# EAGLE design mpg-200-prototype_v2 (EAGLE 6.2)
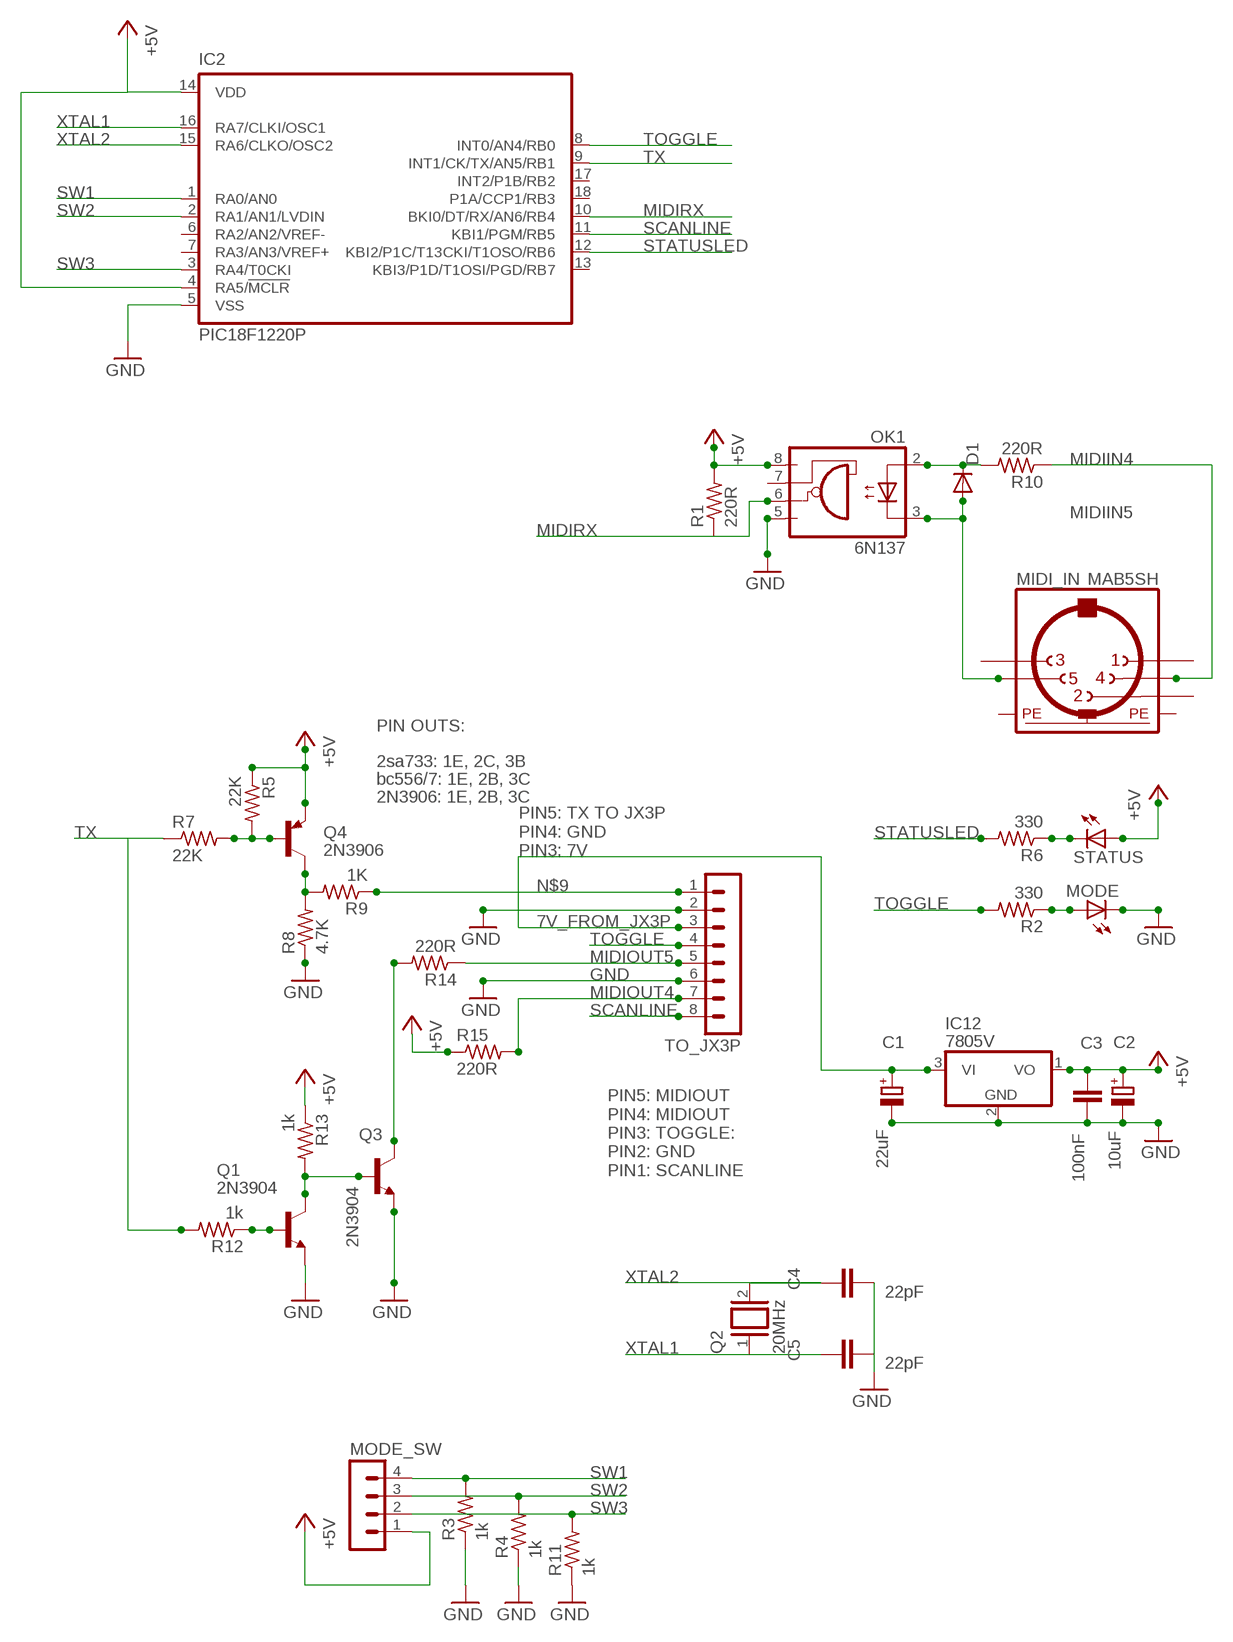
[diagram p0: schematic, sheet 1]

## Parts
C1  22uF  CPOL-EUE2.5-5  [E2,5-5]
C2  10uF  CPOL-EUE2.5-5  [E2,5-5]
C3  100nF  C-EUC0805  [C0805]
C4  22pF  C-EUC0805  [C0805]
C5  22pF  C-EUC0805  [C0805]
D1  DIODE-SOD80C  [SOD80C]
IC2  PIC18F1220P  [DIL18]
IC12  7805V  7805L  [TO92]
MIDI_IN  MAB5SH  [MAB5SH]
MODE  LED3MM  [LED3MM]
MODE_SW  MA04-1  [MA04-1]
OK1  6N137  [DIL08]
Q1  2N3904  [TO92]
Q2  20MHz  XTAL/S  [QS]
Q3  2N3904  [TO92]
Q4  2N3906  [TO92]
R1  220R  R-US_R0805  [R0805]
R2  330  R-US_R0805  [R0805]
R3  1k  R-US_R0805  [R0805]
R4  1k  R-US_R0805  [R0805]
R5  22K  R-US_R0805  [R0805]
R6  330  R-US_R0805  [R0805]
R7  22K  R-US_R0805  [R0805]
R8  4.7K  R-US_R0805  [R0805]
R9  1K  R-US_R0805  [R0805]
R10  220R  R-US_R0805  [R0805]
R11  1k  R-US_R0805  [R0805]
R12  1k  R-US_R0805  [R0805]
R13  1k  R-US_R0805  [R0805]
R14  220R  R-US_R0805  [R0805]
R15  220R  R-US_R0805  [R0805]
STATUS  LED3MM  [LED3MM]
TO_JX3P  MA08-1  [MA08-1]

## Nets
7V_FROM_JX3P: C1.+ IC12.3(VI) TO_JX3P.3
+5V: C2.+ C3.1 IC2.4(RA5/!MCLR) IC2.14(VDD) IC12.1(VO) MODE_SW.1 OK1.8(VCC) Q4.1(E) R1.2 R5.1 R13.1 R15.1 STATUS.A
GND: C1.- C2.- C3.2 C4.2 C5.2 IC2.5(VSS) IC12.2(GND) MODE.K(C) OK1.5(GND) Q1.1(E) Q3.1(E) R3.1 R4.1 R8.1 R11.1 TO_JX3P.2 TO_JX3P.6
MIDIIN4: MIDI_IN.4 R10.1
MIDIIN5: D1.A MIDI_IN.5 OK1.3(C)
MIDIOUT4: R15.2 TO_JX3P.7
MIDIOUT5: R14.1 TO_JX3P.5
MIDIRX: IC2.10(BKI0/DT/RX/AN6/RB4) OK1.6(VO) R1.1
N$1: R6.1 STATUS.K(C)
N$2: Q4.2(B) R5.2 R7.2
N$3: MODE.A R2.1
N$4: Q1.2(B) R12.1
N$5: D1.C OK1.2(A) R10.2
N$6: Q4.3(C) R8.2 R9.2
N$7: Q1.3(C) Q3.2(B) R13.2
N$8: Q3.3(C) R14.2
N$9: R9.1 TO_JX3P.1
SCANLINE: IC2.11(KBI1/PGM/RB5) TO_JX3P.8
STATUSLED: IC2.12(KBI2/P1C/T13CKI/T1OSO/RB6) R6.2
SW1: IC2.1(RA0/AN0) MODE_SW.4 R3.2
SW2: IC2.2(RA1/AN1/LVDIN) MODE_SW.3 R4.2
SW3: IC2.3(RA4/T0CKI) MODE_SW.2 R11.2
TOGGLE: IC2.8(INT0/AN4/RB0) R2.2 TO_JX3P.4
TX: IC2.9(INT1/CK/TX/AN5/RB1) R7.1 R12.2
XTAL1: C5.1 IC2.16(RA7/CLKI/OSC1) Q2.1
XTAL2: C4.1 IC2.15(RA6/CLKO/OSC2) Q2.2
Unconnected: IC2.6(RA2/AN2/VREF-) IC2.7(RA3/AN3/VREF+) IC2.13(KBI3/P1D/T1OSI/PGD/RB7) IC2.17(INT2/P1B/RB2) IC2.18(P1A/CCP1/RB3) MIDI_IN.1 MIDI_IN.2 MIDI_IN.3 OK1.7(VE)

## Notes on the sheet
- PIN OUTS:
- 2sa733: 1E, 2C, 3B
- bc556/7: 1E, 2B, 3C
- 2N3906: 1E, 2B, 3C
- PIN5: TX TO JX3P
  PIN4: GND
  PIN3: 7V
- PIN5: MIDIOUT
  PIN4: MIDIOUT
  PIN3: TOGGLE:
  PIN2: GND
  PIN1: SCANLINE

## Power pins joined to a net without a drawn wire
PE: MIDI_IN.PE MIDI_IN.PE@(PE)

## Library data of the parts
C1 C2 = rcl:CPOL-EU: POLARIZED CAPACITOR, European symbol
C3-C5 = resistor:C-EU: CAPACITOR, European symbol
D1 = diode:DIODE-: DIODE
IC2 = microchip:PIC18F1*20: 18/20/28-Pin High-Performance, Enhanced Flash Microcontrollers with 10-bit A/D and nanoWatt Technology Source: ww1.microchip.com/downloads/en/DeviceDoc/39605c.pdf; MF: MICROCHIP; MPN: PIC18F1220-I/P; OC_FARNELL: 9761977; OC_NEWARK: 92C2429
IC12 = joakim:78*: Positive VOLTAGE REGULATOR Source: http://cache.national.com/ds/LM/LM78L05.pdf http://www.fairchildsemi.com/ds/LM/LM7805.pdf
MIDI_IN = con-hirschmann:MAB5SH: Female CONNECTOR 5 pins 90 deg. with shield, horizontal (DIN 41524)
MODE STATUS = led:LED: LED OSRAM: - CHIPLED LG R971, LG N971, LY N971, LG Q971, LY Q971, LO R971, LY R971 LH N974, LH R974 LS Q976, LO Q976, LY Q976 LO Q996 - Hyper CHIPLED LW Q18S LB Q993, LB Q99A, LB R99A - SideLED LS A670, LO A670, LY A670, LG A670, LP A670 LB A673, LV A673, LT A673, LW A673 LH A674 LY A675 LS A676, LA A676, LO A676, LY A676, LW A676 LS A679, LY A679, LG A679 - Hyper Micro SIDELED® LS Y876, LA Y876, LO Y876, LY Y876 LT Y87S - SmartLED LW L88C, LW L88S LB L89C, LB L89S, LG L890 LS L89K, LO L89K, LY L89K LS L896, LA L896, LO L896, LY L896 - TOPLED LS T670, LO T670, LY T670, LG T670, LP T670 LSG T670, LSP T670, LSY T670, LOP T670, LYG T670 LG T671, LOG T671, LSG T671 LB T673, LV T673, LT T673, LW T673 LH T674 LS T676, LA T676, LO T676, LY T676, LB T676, LH T676, LSB T676, LW T676 LB T67C, LV T67C, LT T67C, LS T67K, LO T67K, LY T67K, LW E67C LS E67B, LA E67B, LO E67B, LY E67B, LB E67C, LV E67C, LT E67C LW T67C LS T679, LY T679, LG T679 LS T770, LO T770, LY T770, LG T770, LP T770 LB T773, LV T773, LT T773, LW T773 LH T774 LS E675, LA E675, LY E675, LS T675 LS T776, LA T776, LO T776, LY T776, LB T776 LHGB T686 LT T68C, LB T68C - Hyper Mini TOPLED® LB M676 - Mini TOPLED Santana® LG M470 LS M47K, LO M47K, LY M47K Source: http://www.osram.convergy.de LUXEON: - LUMILED® LXK2-PW12-R00, LXK2-PW12-S00, LXK2-PW14-U00, LXK2-PW14-V00 LXK2-PM12-R00, LXK2-PM12-S00, LXK2-PM14-U00 LXK2-PE12-Q00, LXK2-PE12-R00, LXK2-PE12-S00, LXK2-PE14-T00, LXK2-PE14-U00 LXK2-PB12-K00, LXK2-PB12-L00, LXK2-PB12-M00, LXK2-PB14-N00, LXK2-PB14-P00, LXK2-PB14-Q00 LXK2-PR12-L00, LXK2-PR12-M00, LXK2-PR14-Q00, LXK2-PR14-R00 LXK2-PD12-Q00, LXK2-PD12-R00, LXK2-PD12-S00 LXK2-PH12-R00, LXK2-PH12-S00 LXK2-PL12-P00, LXK2-PL12-Q00, LXK2-PL12-R00 Source: www.luxeon.com KINGBRIGHT: KA-3528ASYC Source: www.kingbright.com
MODE_SW = con-lstb:MA04-1: PIN HEADER; OC_FARNELL: unknown; OC_NEWARK: unknown
OK1 = optocoupler:6N137: MOTOROLA OPTO COUPLER
Q1 Q3 = joakim:2N3904: NPN Transistor
Q2 = special:XTAL/S: CRYSTAL
Q4 = joakim:2N3906: PNP Transistor
R1-R15 = resistor:R-US_: RESISTOR, American symbol
TO_JX3P = con-lstb:MA08-1: PIN HEADER

## Board
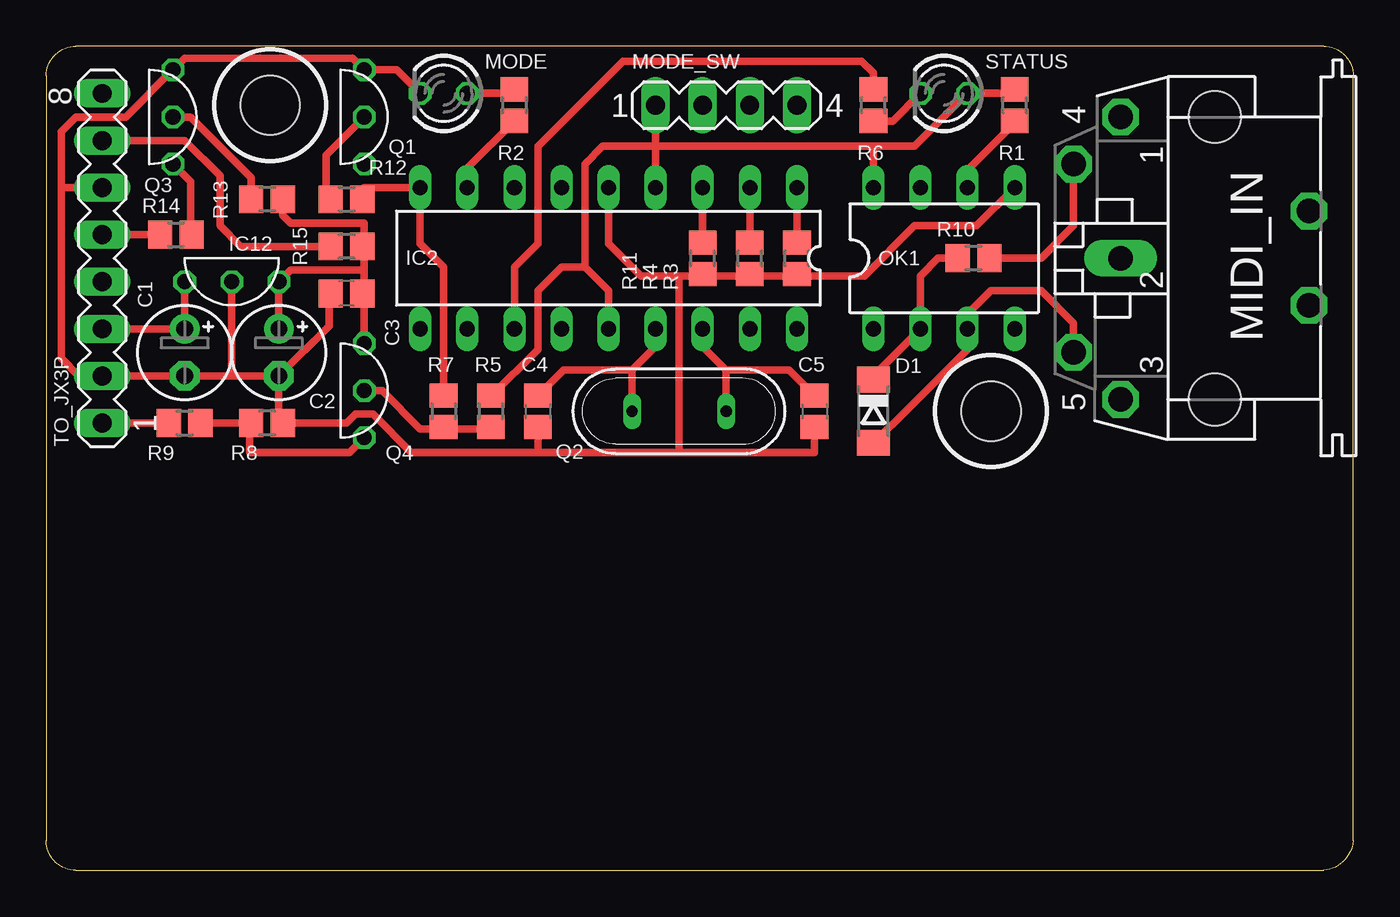
[diagram p1: board, top side]
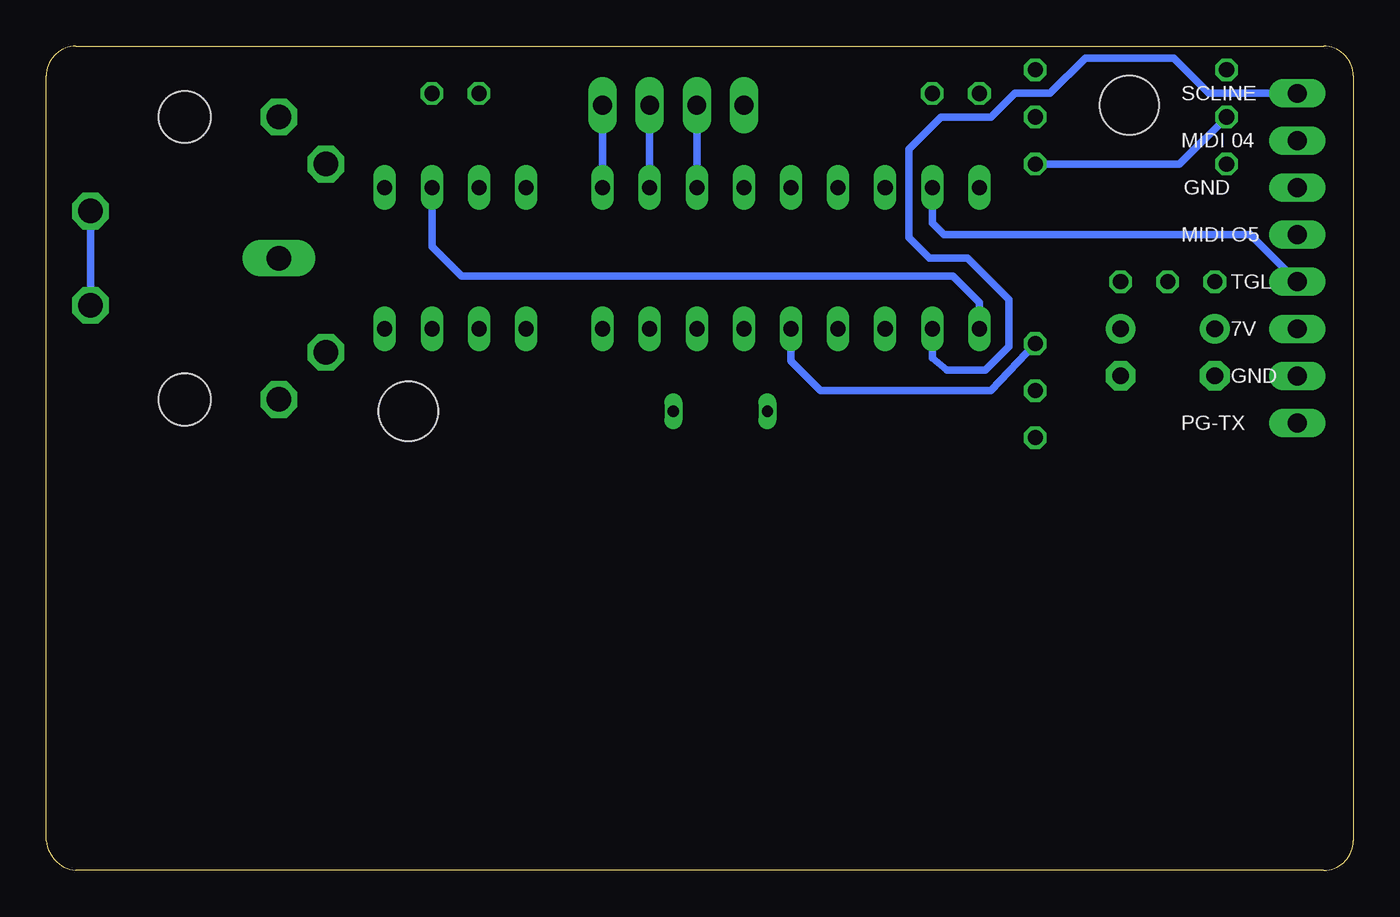
[diagram p2: board, bottom side, seen from below]

Size 70.48 x 44.45 mm. Coordinates in mm from the lower left corner, seen from the top.
Outline: 1.59,0 68.9,0 arc80 70.48,1.59 70.48,42.86 arc90 68.9,44.45 1.59,44.45 arc90 0,42.86 0,1.59 arc90 1.59,0
Copper layers (1*16): Top 0.0356mm / dielectric 1.5011mm / Bottom 0.0356mm
Design rules: minimum track width 6mil, minimum drill 13mil, track to track 6mil, track to pad 6mil, pad to pad 6mil, via to via 6mil, smd to smd 6mil, copper to edge 15mil, drill to drill 6mil, minimum pad ring 7mil, minimum via ring 7mil, stop-mask expansion 3mil, vias tented up to drill 0mil, thermal gap 10mil
Holes 3.2 mm at 50.96,24.77 12.06,41.27

### Footprints (pad centres in the part's own frame; a part is rotated, then mirrored left to right if it is on the bottom)
E2,5-5 = drill 0.9 pad 1.6: + -1.27,0 | drill 0.9 pad 1.6 octagon: - 1.27,0
C0805 = smd 1.3 x 1.5: 1 -0.85,0; 2 0.85,0
SOD80C = smd 1.4 x 1.8: A 1.7,0; C -1.7,0
DIL18 = drill 0.813 long: 1 -10.16,-3.81; 2 -7.62,-3.81; 3 -5.08,-3.81; 4 -2.54,-3.81; 5 0,-3.81; 6 2.54,-3.81; 7 5.08,-3.81; 8 7.62,-3.81; 9 10.16,-3.81; 10 10.16,3.81; 11 7.62,3.81; 12 5.08,3.81; 13 2.54,3.81; 14 0,3.81; 15 -2.54,3.81; 16 -5.08,3.81; 17 -7.62,3.81; 18 -10.16,3.81
TO92 = drill 0.813 octagon: 1 -2.54,0; 2 0,0; 3 2.54,0
MAB5SH = drill 1.321 octagon: 1 7.62,5.08; 3 -7.62,5.08; 4 5.08,7.62; 5 -5.08,7.62; PE -2.54,-5.08; PE@ 2.54,-5.08 | drill 1.321 long: 2 0,5.08 | hole 2.794: 7.62,0; -7.62,0
LED3MM = drill 0.813 octagon: A -1.27,0; K 1.27,0
MA04-1 = drill 1.016 long: 1 -3.81,0; 2 -1.27,0; 3 1.27,0; 4 3.81,0
DIL08 = drill 0.813 long: 1 -3.81,-3.81; 2 -1.27,-3.81; 3 1.27,-3.81; 4 3.81,-3.81; 5 3.81,3.81; 6 1.27,3.81; 7 -1.27,3.81; 8 -3.81,3.81
QS = drill 0.61 long: 1 -2.54,0; 2 2.54,0
R0805 = smd 1.3 x 1.5: 1 -0.85,0; 2 0.85,0
MA08-1 = drill 1.016 long: 1 -8.89,0; 2 -6.35,0; 3 -3.81,0; 4 -1.27,0; 5 1.27,0; 6 3.81,0; 7 6.35,0; 8 8.89,0

### Placement (x,y rotation side)
C1  7.46,27.94 270 top
C2  12.54,27.94 270 top
C3  16.19,31.11 180 top
C4  26.51,24.77 270 top
C5  41.43,24.77 270 top
D1  44.61,24.77 270 top
IC2  30.32,33.02 180 top
IC12  10,31.75 180 top
MIDI_IN  63.02,33.02 90 top
MODE  21.43,41.91 180 top
MODE_SW  36.67,41.27 0 top
OK1  48.42,33.02 0 top
Q1  17.14,40.64 270 top
Q2  34.13,24.77 180 top
Q3  6.83,40.64 270 top
Q4  17.14,25.88 270 top
R1  52.23,41.27 90 top
R2  25.24,41.27 270 top
R3  40.48,33.02 90 top
R4  37.94,33.02 90 top
R5  23.97,24.77 270 top
R6  44.61,41.27 90 top
R7  21.43,24.77 270 top
R8  11.91,24.13 180 top
R9  7.46,24.13 0 top
R10  50.01,33.02 180 top
R11  35.4,33.02 90 top
R12  16.19,36.2 0 top
R13  11.91,36.2 180 top
R14  6.99,34.29 0 top
R15  16.19,33.66 180 top
STATUS  48.42,41.91 180 top
TO_JX3P  3.02,33.02 90 top

### Tracks (layer width: path | path; a pad name or v marks a point on that pad's centre or on a via)
7V_FROM_JX3P
  Top 0.406: IC12.3 C1.+ TO_JX3P.3
+5V
  Top 0.406: IC2.14 30.32,31.27 29.05,32.54 | 29.05,32.54 29.05,38.1 30,39.05 32.86,39.05 | 17.14,32.38 17.14,33.97 17.04,34.08 R15.1 17.14,33.76 17.14,34.92 13.18,34.92 12.76,35.34 R13.1 | 17.14,32.38 17.14,31.85 C3.1 17.04,31.54 17.14,31.43 Q4.1 | 17.14,32.38 13.18,32.38 IC12.1 C2.+ | R5.1 24.03,25.61 26.51,28.1 26.51,31.27 27.78,32.54 29.05,32.54 | R1.2 52.23,41.91 STATUS.A 46.83,39.05 44.61,39.05 | MODE_SW.1 32.86,39.05 | 32.86,39.05 44.61,39.05 | OK1.8 44.61,39.05 | 32.86,39.05 IC2.4
  Bottom 0.406: Q4.1 19.53,25.88 28.73,25.88 30.32,27.46 IC2.14
GND
  Top 0.406: C2.- 12.54,24.13 R8.1 16.19,24.13 16.67,24.61 17.62,24.61 19.68,22.54 26.51,22.54 | IC2.5 30.32,33.81 32.07,32.07 34.13,32.07 | 26.51,22.54 34.29,22.54 | 34.29,22.54 41.43,22.54 C5.2 | 35.56,32.07 35.46,32.17 R11.1 | 35.56,32.07 37.84,32.07 | 35.56,32.07 34.13,32.07 | 34.13,32.07 34.13,22.7 34.29,22.54 | C2.- 15.24,29.37 15.24,31.65 C3.2 | IC12.2 10,26.67 | 10,26.67 C1.- TO_JX3P.2 1.75,26.67 0.79,27.62 0.79,36.83 | 10,26.67 C2.- | C4.2 26.51,22.54 | 0.79,36.83 0.79,39.85 1.59,40.64 4.29,40.64 Q3.1 7.46,43.81 16.51,43.81 Q1.1 18.89,43.18 MODE.K | TO_JX3P.6 0.79,36.83 | 37.84,32.07 40.64,32.07 | 40.64,32.07 44.13,32.07 46.83,34.77 50.16,34.77 OK1.5 | 37.84,32.07 R4.1 | R3.1 40.54,32.17 40.64,32.07
MIDIIN4
  Top 0.406: MIDI_IN.4 55.4,34.77 53.66,33.02 R10.1
MIDIIN5
  Top 0.406: D1.A 44.72,23.18 45.88,24.29 49.69,28.1 OK1.3 49.69,30 50.96,31.27 53.66,31.27 55.4,29.53 MIDI_IN.5
MIDIOUT4
  Top 0.406: R15.2 10.48,33.66 9.37,34.77 9.37,37.47 7.46,39.37 TO_JX3P.7
MIDIOUT5
  Top 0.406: TO_JX3P.5 R14.1
MIDIRX
  Top 0.406: R1.1 52.23,40.32 49.69,37.78 OK1.6
  Bottom 0.406: IC2.10 20.16,30.64 21.59,32.07 48.1,32.07 49.69,33.66 OK1.6
N$1
  Top 0.406: R6.1 45.66,40.42 STATUS.K
N$2
  Top 0.406: Q4.2 18.1,25.88 20.16,23.81 21.33,23.81 R7.2 21.43,23.81 23.87,23.81 R5.2
N$3
  Top 0.406: MODE.A 25.03,41.91 R2.1
N$4
  Top 0.406: Q1.2 15.08,38.58 15.08,36.46 R12.1
N$5
  Top 0.406: 49.37,33.02 R10.2 | D1.C 44.72,26.78 OK1.2 47.15,32.07 48.1,33.02 R10.2 | 49.1,33.08 R10.2
N$6
  Top 0.406: Q4.3 16.35,22.54 10.95,22.54 10.95,24.03 R8.2 R9.2
N$7
  Top 0.406: Q3.2 7.78,40.64 11.06,37.36 R13.2
  Bottom 0.406: Q1.3 9.37,38.1 Q3.2
N$8
  Top 0.406: Q3.3 7.78,37.15 7.78,33.87 R14.2
N$9
  Top 0.406: TO_JX3P.1 R9.1
PE
  Bottom 0.406: MIDI_IN.PE@ MIDI_IN.PE
SCANLINE
  Bottom 0.406: TO_JX3P.8 7.78,41.91 9.68,43.81 14.45,43.81 16.35,41.91 18.26,41.91 19.53,40.64 22.23,40.64 23.97,38.89 23.97,34.13 22.86,33.02 20.8,33.02 18.57,30.8 18.57,28.26 19.84,26.99 21.91,26.99 22.7,27.62 IC2.11
STATUSLED
  Top 0.406: IC2.12 25.24,32.54 26.51,33.81 26.51,39.05 31.11,43.66 43.97,43.66 44.61,43.02 R6.2
SW1
  Top 0.406: 40.48,33.81 R3.2 IC2.1
  Bottom 0.406: MODE_SW.4 IC2.1
SW2
  Top 0.406: R4.2 IC2.2
  Bottom 0.406: MODE_SW.3 IC2.2
SW3
  Top 0.406: R11.2 IC2.3
  Bottom 0.406: MODE_SW.2 IC2.3
TOGGLE
  Top 0.406: IC2.8 22.7,37.88 R2.2
  Bottom 0.406: TO_JX3P.4 5.56,34.29 22.07,34.29 22.7,34.92 IC2.8
TX
  Top 0.406: R12.2 17.04,36.73 17.14,36.83 IC2.9 20.16,33.81 21.43,32.54 R7.1
XTAL1
  Top 0.406: IC2.16 35.4,28.26 36.67,26.99 | 36.67,26.99 40.06,26.99 C5.1 | 36.67,26.99 Q2.1
XTAL2
  Top 0.406: IC2.15 32.86,28.26 31.59,26.99 | 31.59,26.99 27.88,26.99 C4.1 | 31.59,26.99 Q2.2

### Text on the board
bNames: SCLINE | MIDI 04 | GND | MIDI O5 | TGL | 7V | GND | PG-TX